# EAGLE design battery-interface (EAGLE 6.1)
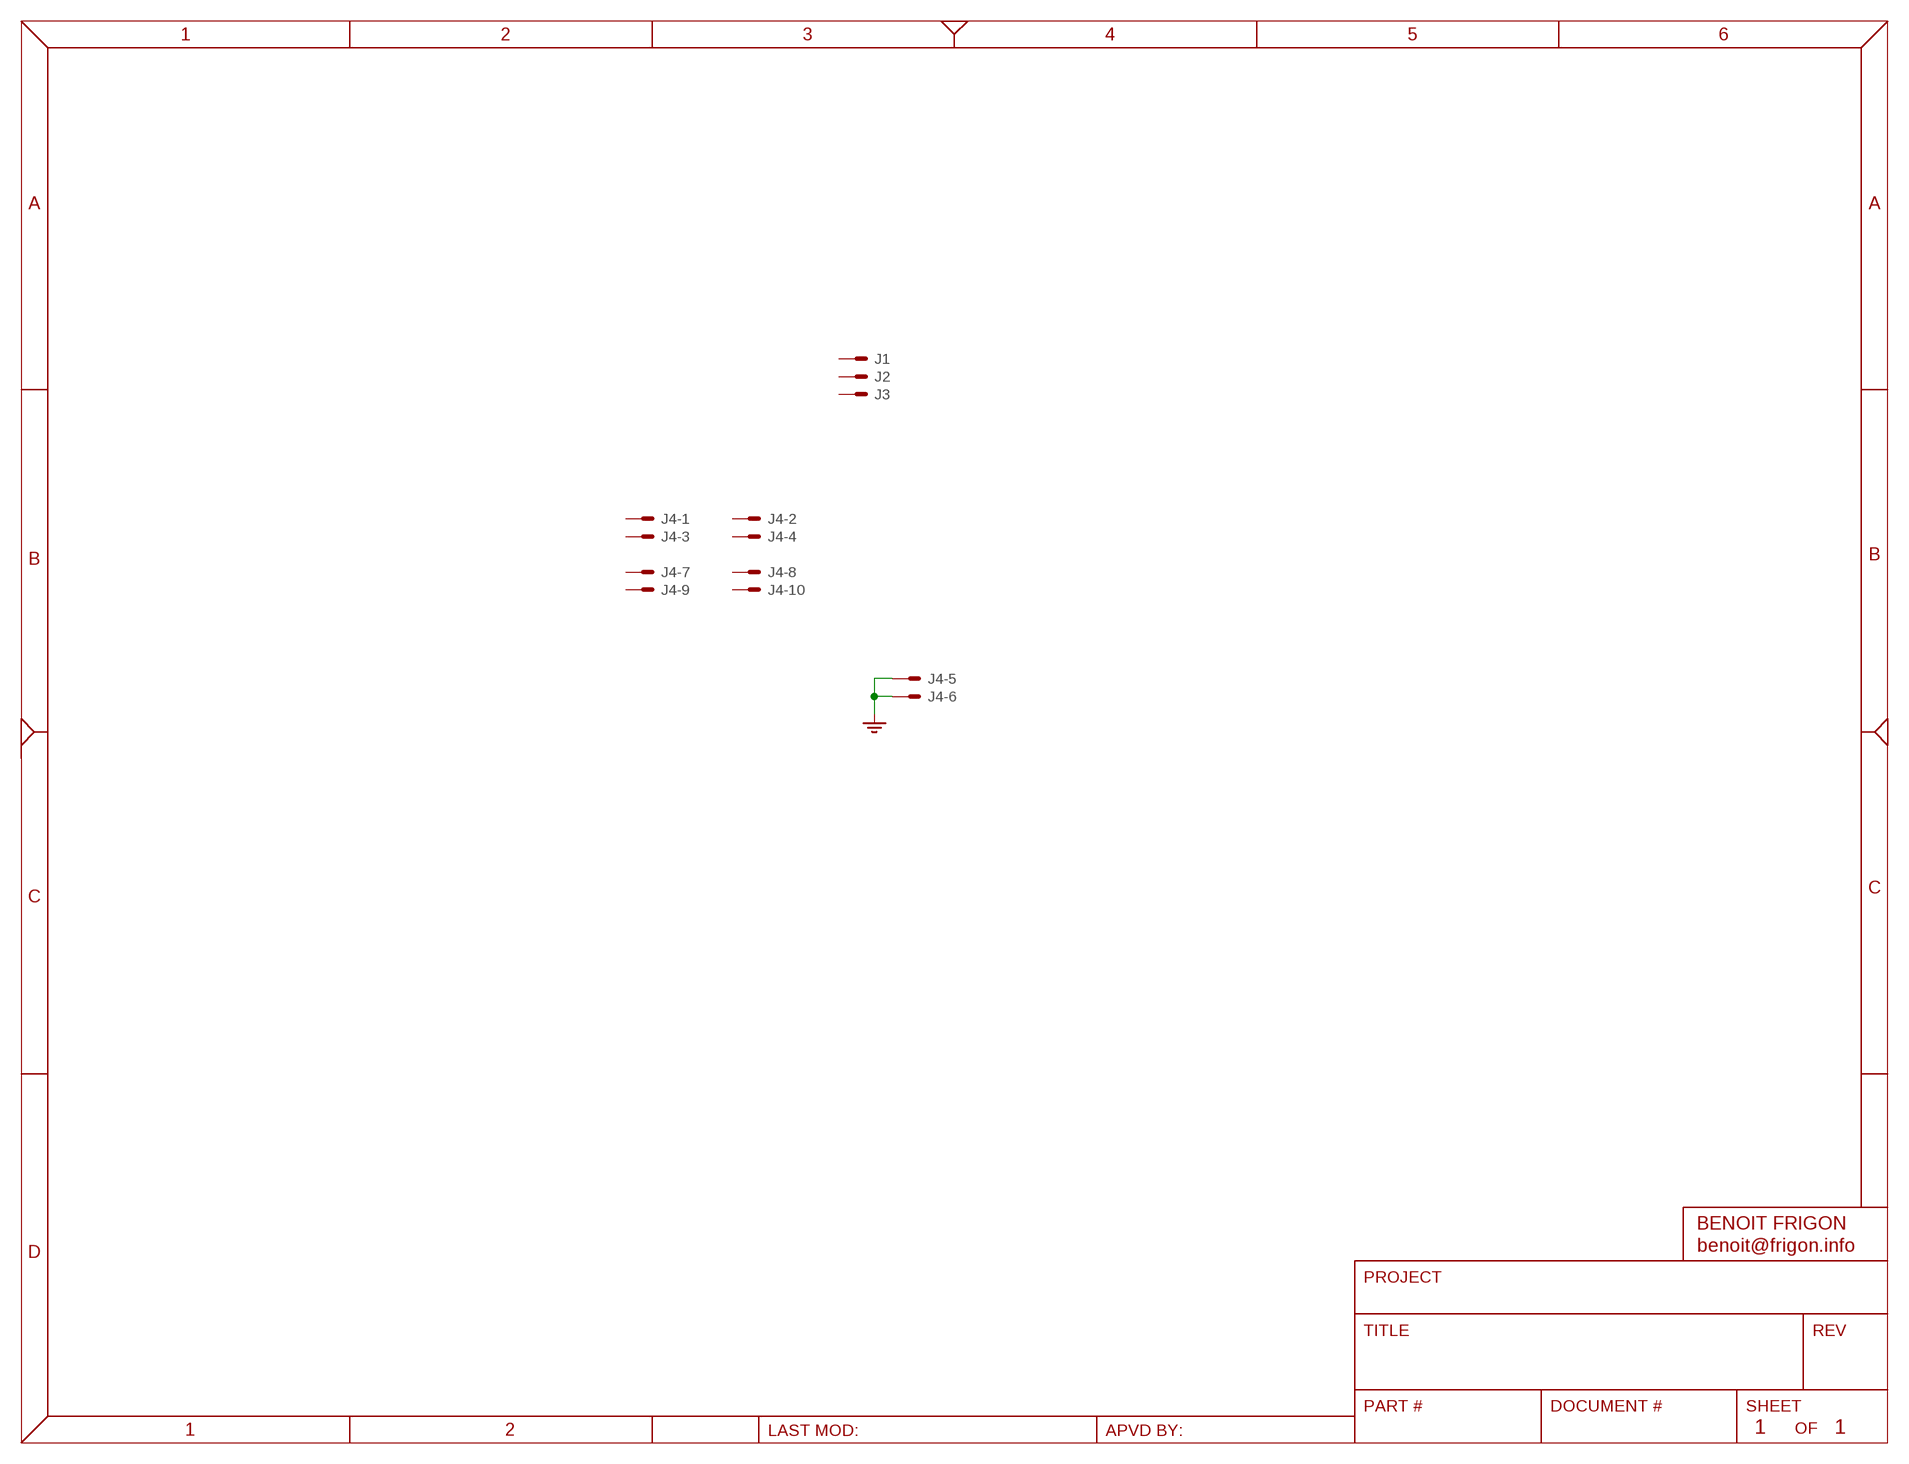
[diagram p0: schematic, sheet 1]

## Parts
J1  SNG-100-HEADER-01-HDR-V  [HDR_M_1]
J2  SNG-100-HEADER-01-HDR-V  [HDR_M_1]
J3  SNG-100-HEADER-01-HDR-V  [HDR_M_1]
J4  DL-100-HEADER-10-V  [534206-5]

## Nets
GND: J4.5 J4.6
Unconnected: J1.1(S) J2.1(S) J3.1(S) J4.1 J4.2 J4.3 J4.4 J4.7 J4.8 J4.9 J4.10

## Library data of the parts
J1-J3 = Connectors:SNG-100-HEADER-01: 1 Pos - 2.54mm header
J4 = Connectors:DL-100-HEADER-10: 10 Pos - Dual Row - 2.54mm; DESCRIPTION: {DESCRIPTION} Receptacle - Vertical; MFG: Tyco Electronics; SKU: 534206-5

## Board
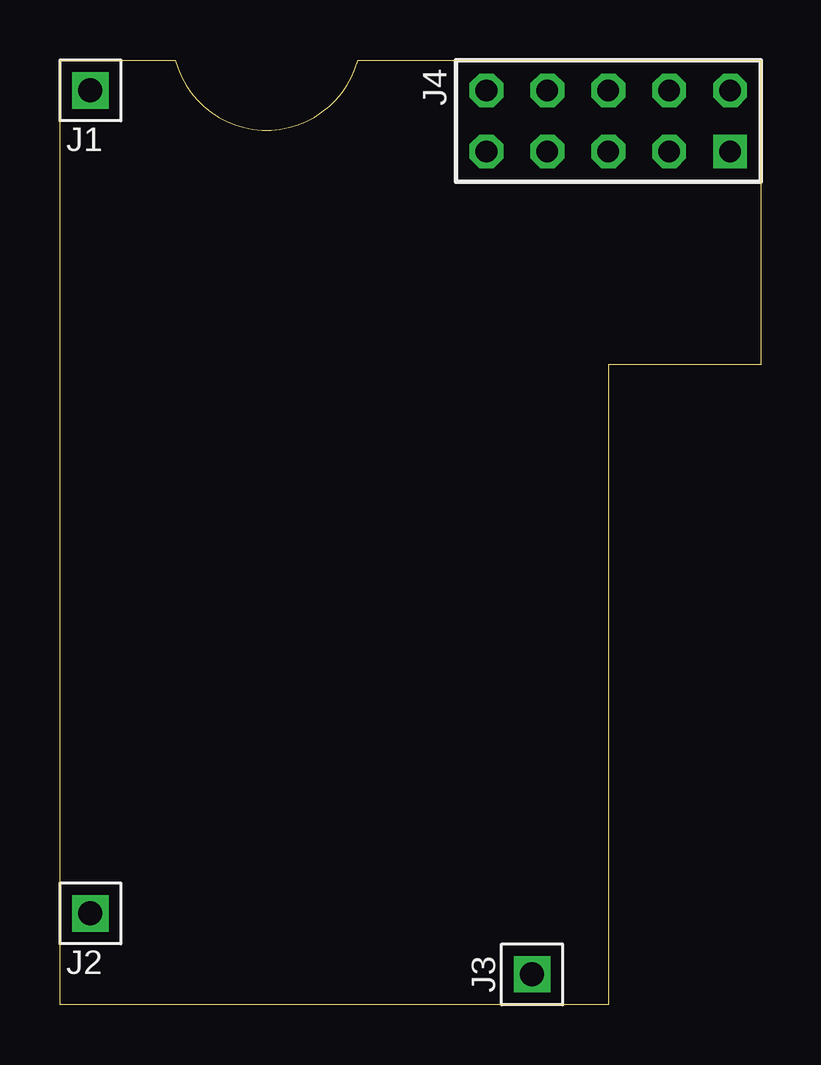
[diagram p1: board, top side]
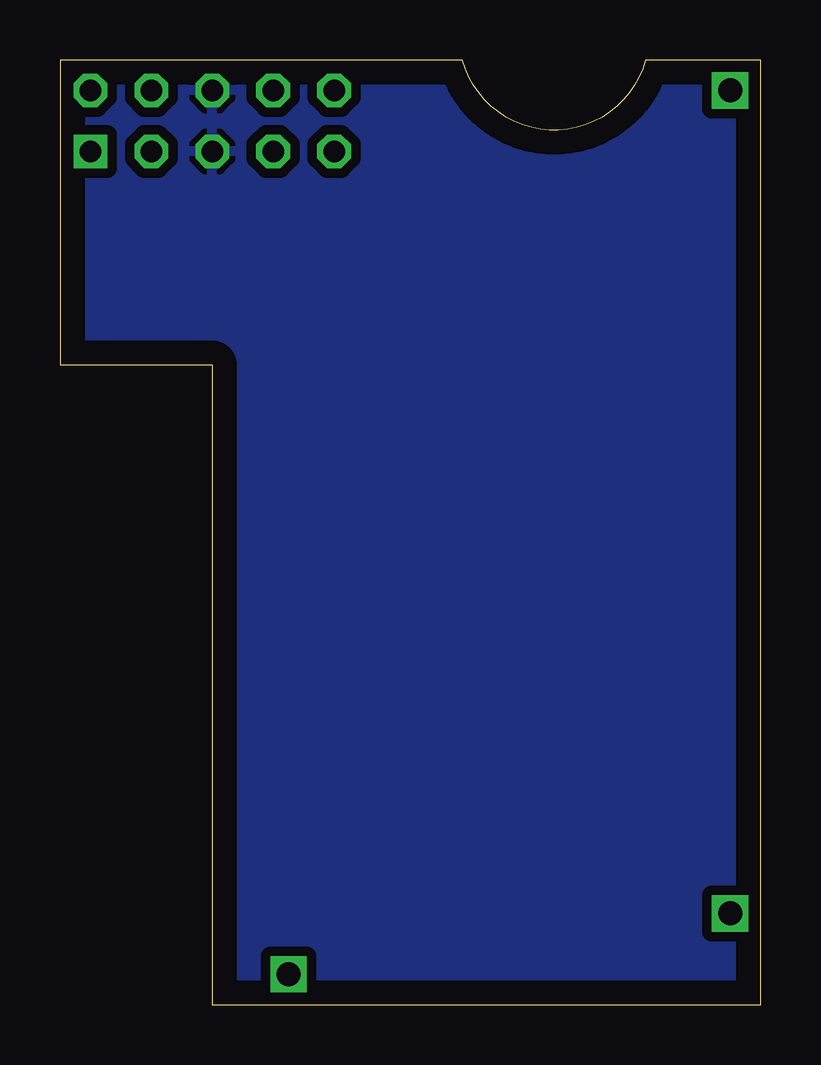
[diagram p2: board, bottom side, seen from below]

Size 29.21 x 39.37 mm. Coordinates in mm from the lower left corner, seen from the top.
Outline: 0,0 0,39.37 4.8,39.37 arc150 12.42,39.37 29.21,39.37 29.21,26.67 22.86,26.67 22.86,0 0,0
Copper layers (1*16): Top 0.035mm / dielectric 1.5mm / Bottom 0.035mm
Design rules: minimum track width 10mil, minimum drill 24mil, track to track 8mil, track to pad 8mil, pad to pad 8mil, via to via 8mil, smd to smd 8mil, copper to edge 40mil, drill to drill 8mil, minimum pad ring 10mil, minimum via ring 8mil, stop-mask expansion 4mil, vias tented up to drill 0mil, thermal gap 10mil

### Footprints (pad centres in the part's own frame; a part is rotated, then mirrored left to right if it is on the bottom)
HDR_M_1 = drill 1 square: 1 0,0
534206-5 = drill 0.9 square: 1 5.08,-1.27 | drill 0.9 octagon: 2 5.08,1.27; 3 2.54,-1.27; 4 2.54,1.27; 5 0,-1.27; 6 0,1.27; 7 -2.54,-1.27; 8 -2.54,1.27; 9 -5.08,-1.27; 10 -5.08,1.27

### Placement (x,y rotation side)
J1  1.27,38.1 0 top
J2  1.27,3.81 0 top
J3  19.68,1.27 0 top
J4  22.86,36.83 0 top

### Tracks (layer width: path | path; a pad name or v marks a point on that pad's centre or on a via)
GND
  pour Bottom (isolate 0.406): -1.27,40.64 -1.27,-0.64 31.75,-0.64 31.75,40.64